# EAGLE design firefly-instrument-serial-wire-debug (EAGLE 7.7.0)
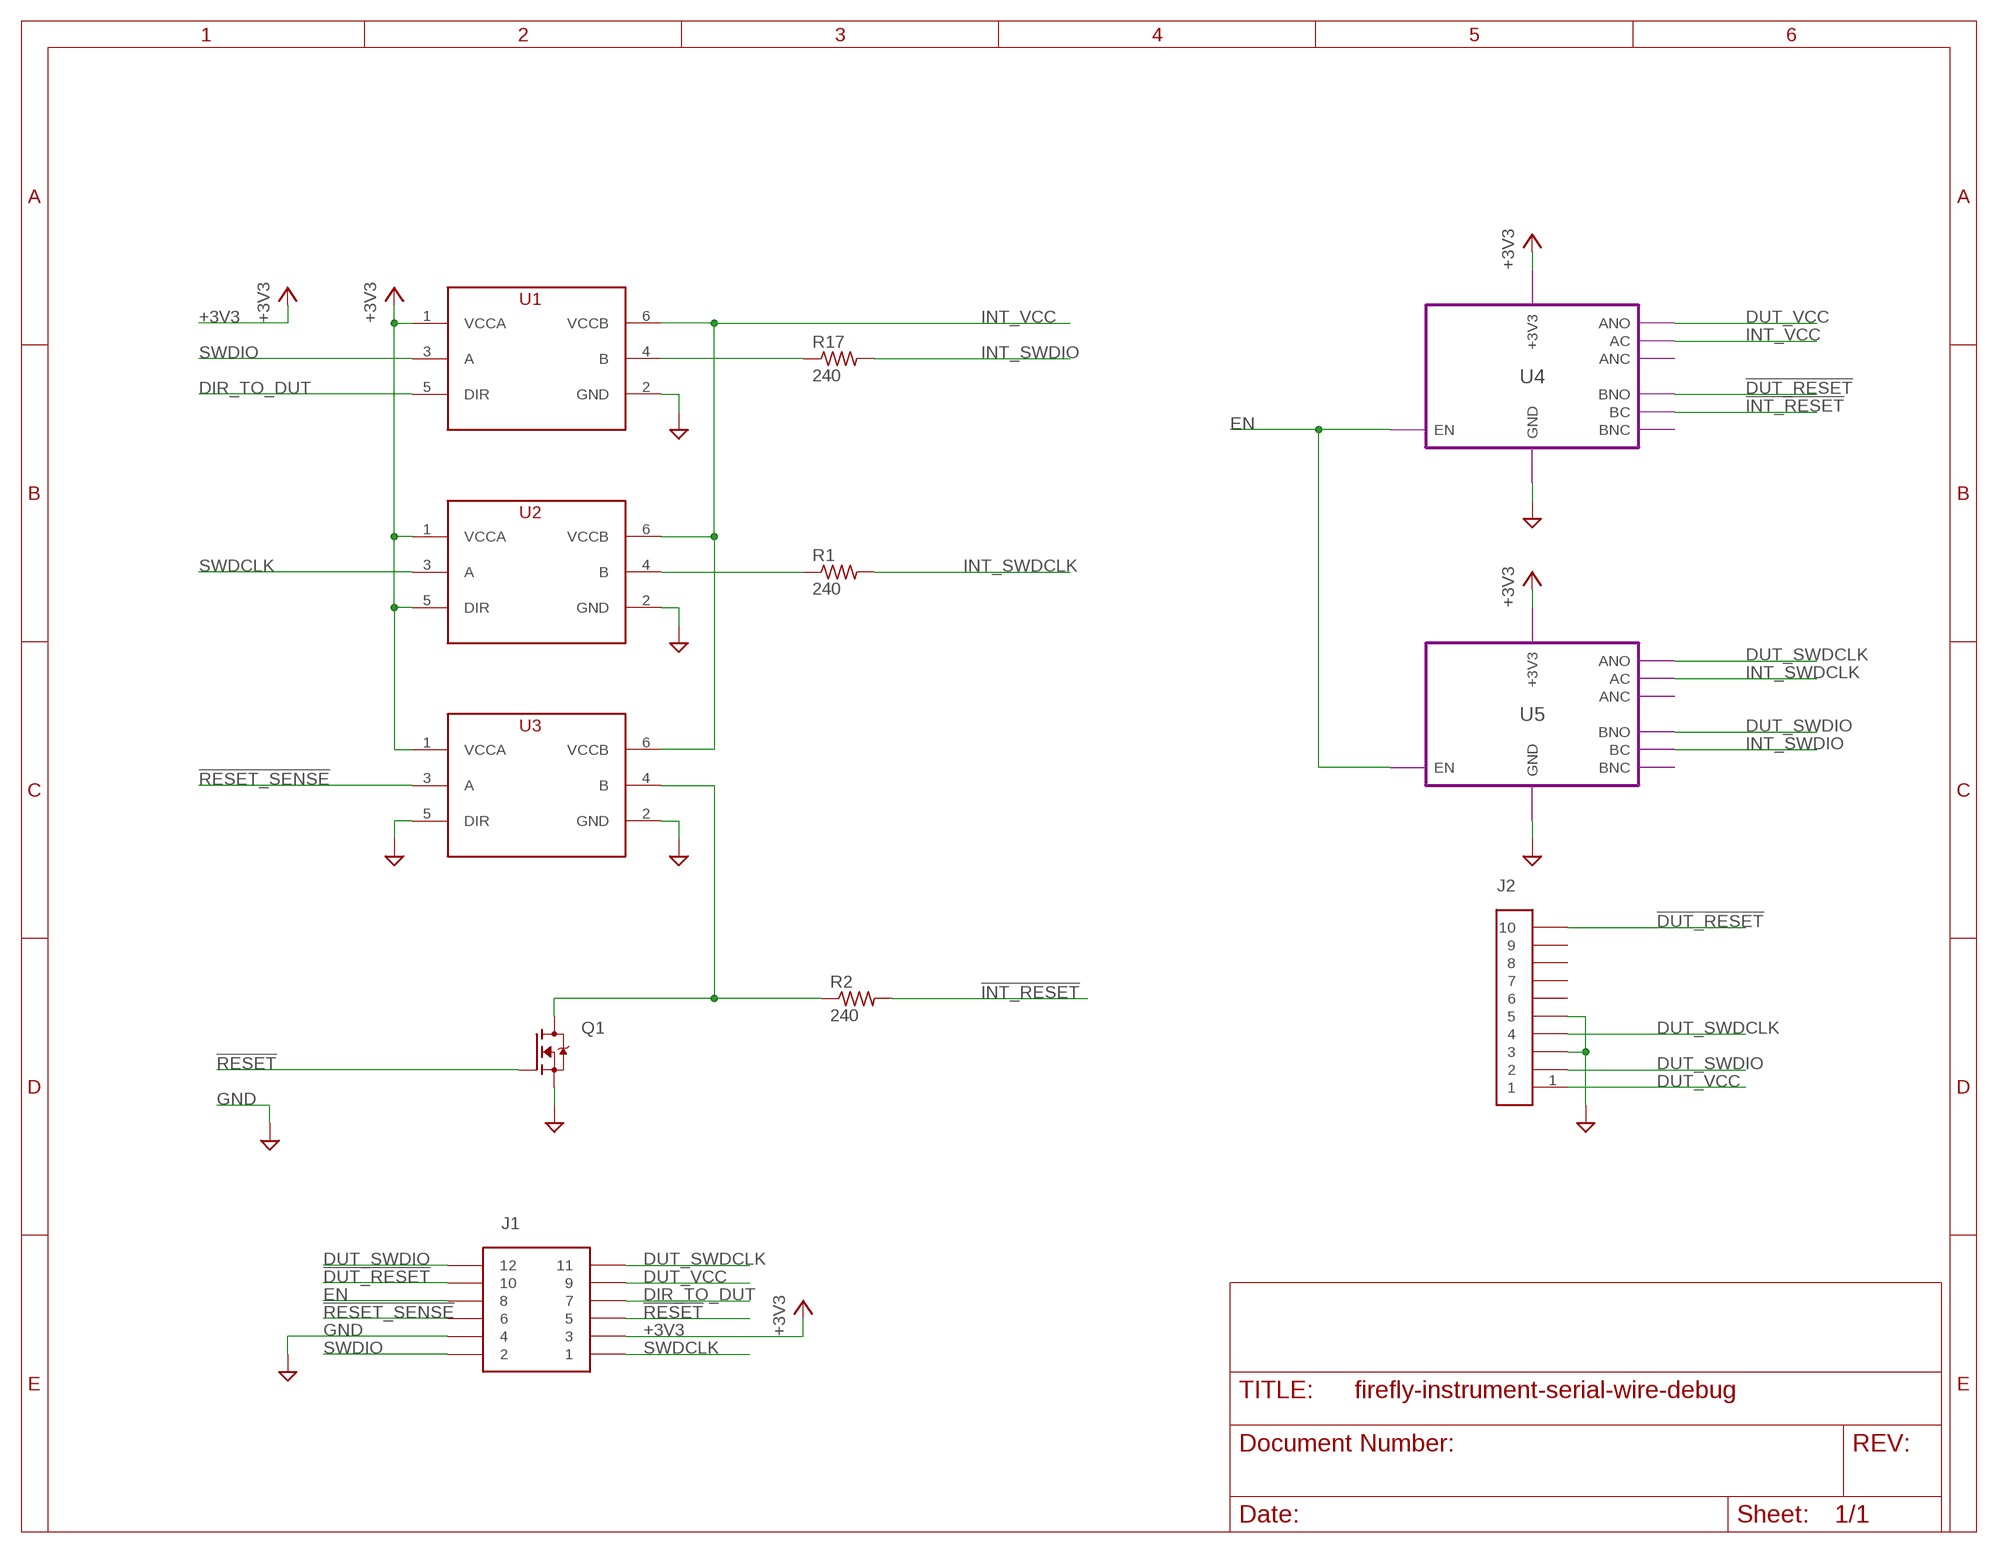
[diagram p0: schematic, sheet 1]

## Parts
J1  CON-12CON-HEADER-2X6  [CON-HEADER-2X6]
J2  CON-10SWD  [SWD-10]
Q1  FET-NMCPH3  [MCPH3]
R1  240  R-USR0805  [R0805]
R2  240  R-USR0805  [R0805]
R17  240  R-USR0805  [R0805]
U1  74LVCH1T45  [SOT363]
U2  74LVCH1T45  [SOT363]
U3  74LVCH1T45  [SOT363]

## Module instances
U4 = RELAY
U5 = RELAY

## Nets
!DUT_RESET: J1.10 J2.10 ; port U4.BNO
!INT_RESET: R2.2 ; port U4.BC
!RESET: J1.5 Q1.1(G)
!RESET_SENSE: J1.6 U3.3(A)
+3V3: J1.3 U1.1(VCCA) U2.1(VCCA) U2.5(DIR) U3.1(VCCA) ; port U4.+3V3 U5.+3V3
DIR_TO_DUT: J1.7 U1.5(DIR)
DUT_SWDCLK: J1.11 J2.4 ; port U5.ANO
DUT_SWDIO: J1.12 J2.2 ; port U5.BNO
DUT_VCC: J1.9 J2.1 ; port U4.ANO
EN: J1.8 ; port U4.EN U5.EN
GND: J1.4 J2.3 J2.5 Q1.2(S) U1.2(GND) U2.2(GND) U3.2(GND) U3.5(DIR) ; port U5.GND U4.GND
INT_SWDCLK: R1.2 ; port U5.AC
INT_SWDIO: R17.2 ; port U5.BC
INT_VCC: U1.6(VCCB) U2.6(VCCB) U3.6(VCCB) ; port U4.AC
N$1: Q1.3(D) R2.1 U3.4(B)
N$2: R17.1 U1.4(B)
N$3: R1.1 U2.4(B)
SWDCLK: J1.1 U2.3(A)
SWDIO: J1.2 U1.3(A)
Unconnected: J2.6 J2.7 J2.8 J2.9

## Library data of the parts
J1 = firefly:CON-12
J2 = firefly:CON-10; MANUFACTURER: Harwin; ORDERING-CODE: M50-3500542
Q1 = firefly:FET-N; MANUFACTURER: ON Semiconductor; ORDERING-CODE: MCH3481-TL-W
R1 R2 R17 = firefly:R-US: RESISTOR, American symbol; MANUFACTURER: Yageo; ORDERING-CODE: RC0805FR-07240RL
U1-U3 = firefly:74LVCH1T45; MANUFACTURER: NXP Semiconductors; ORDERING-CODE: 74LVCH1T45GW,125

## Module RELAY
Ports: ANO(io) AC(io) ANC(io) BNO(io) BC(io) BNC(io) EN(io) +3V3(pwr) GND(pwr)
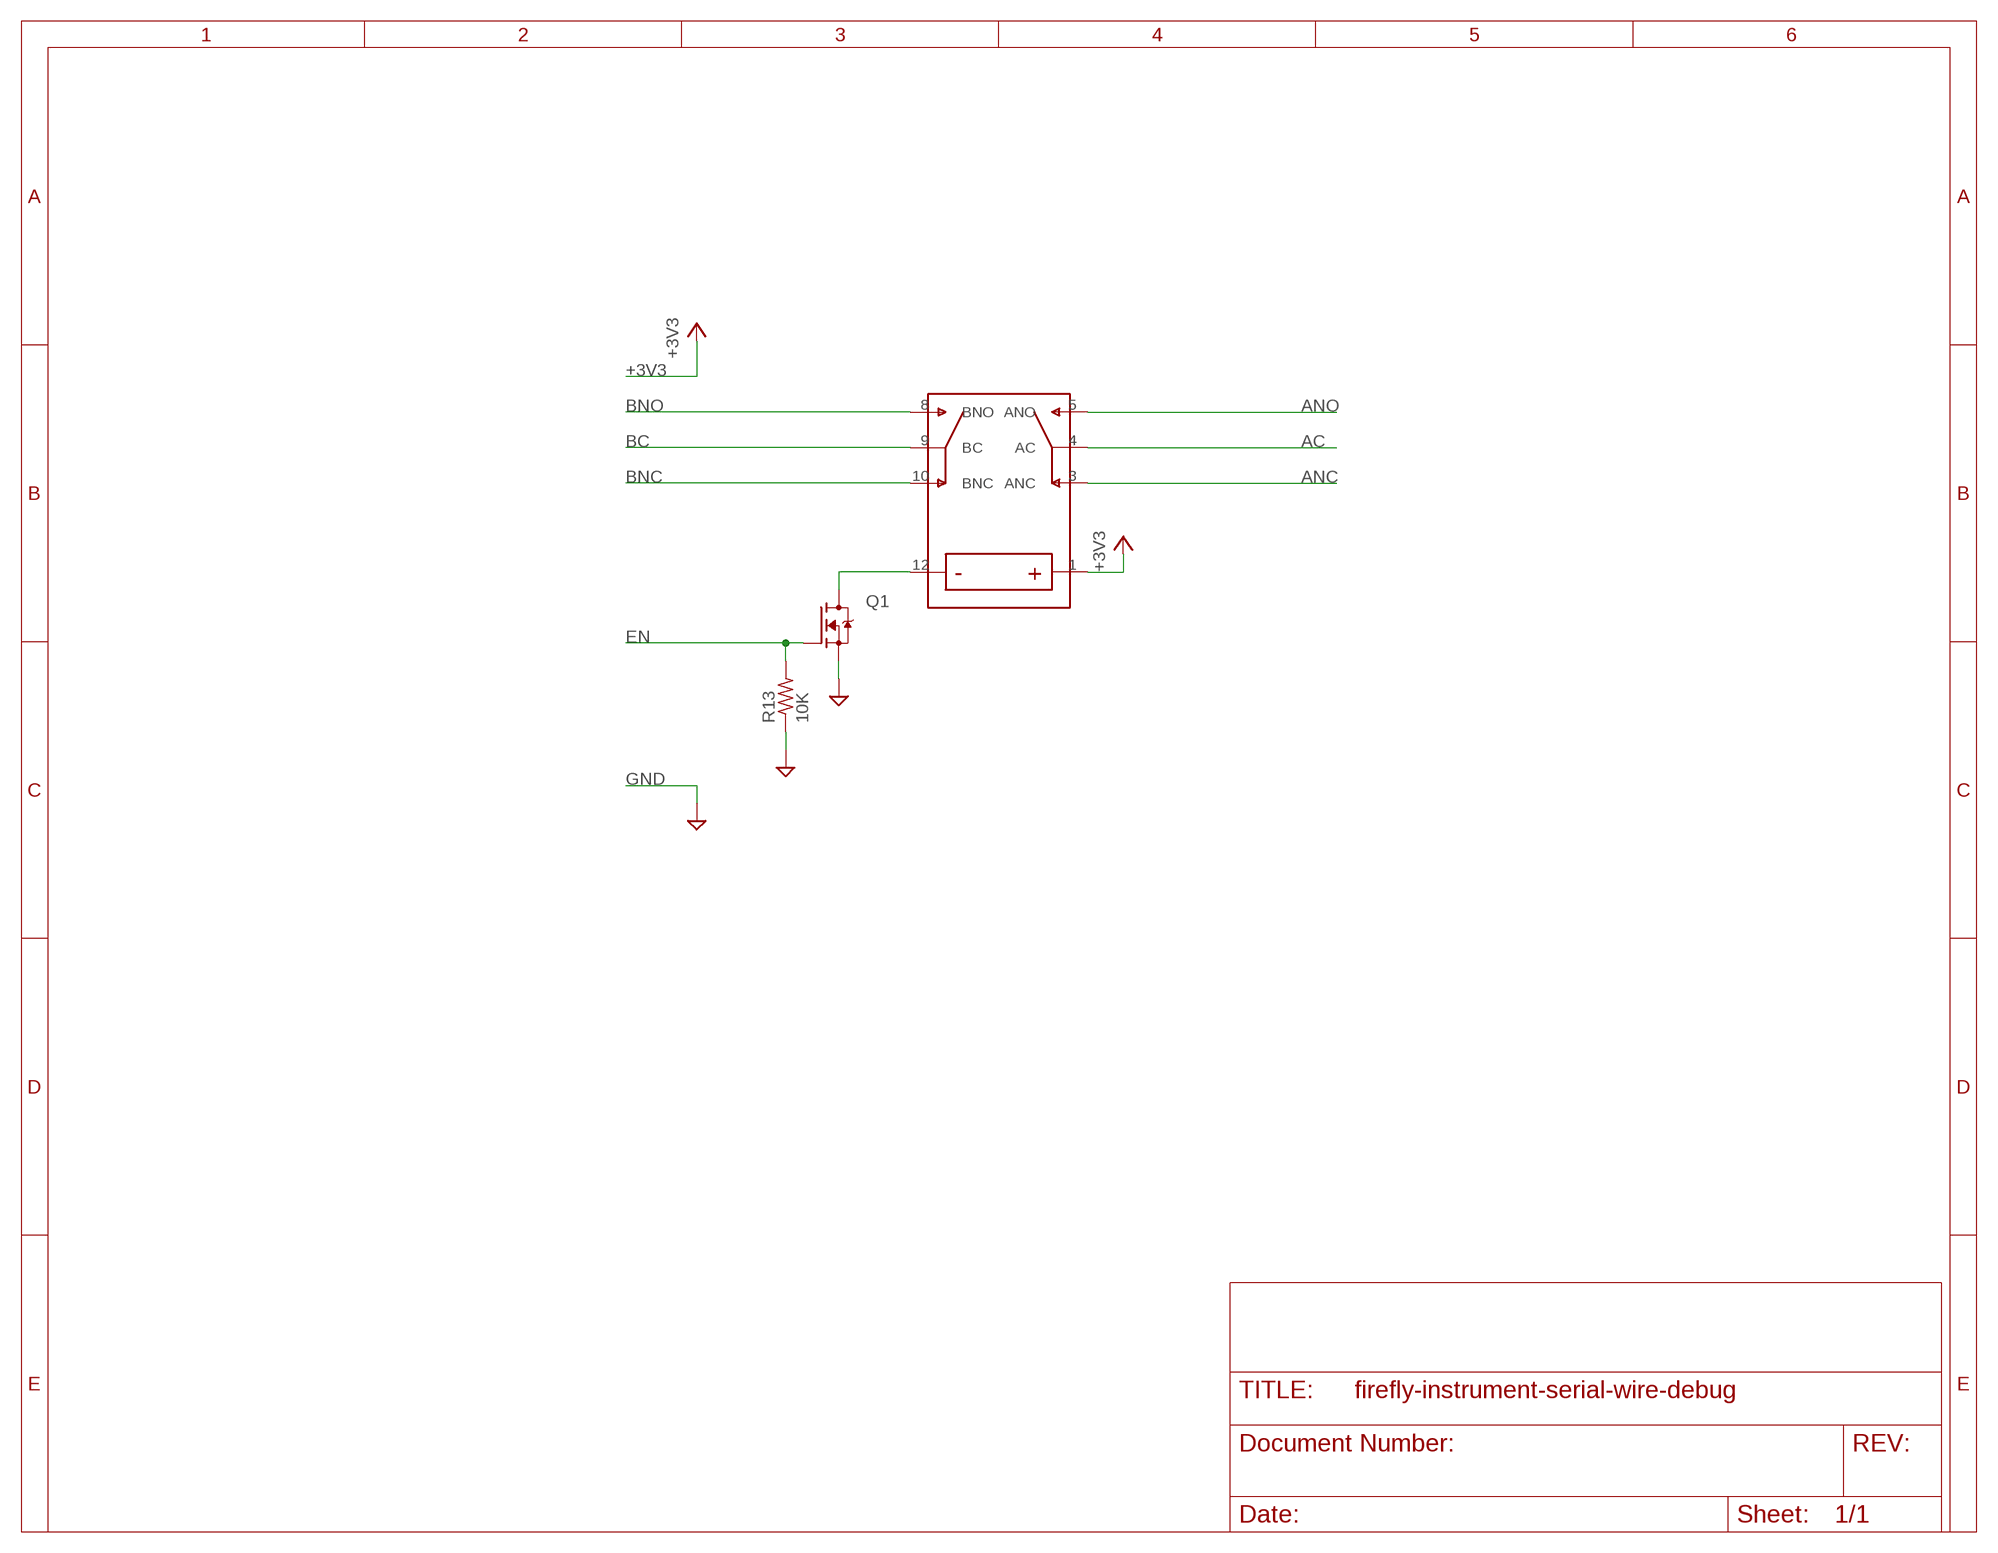
[diagram p1: schematic, module RELAY, sheet 1]

### Parts
Q1  FET-NMCPH3  [MCPH3]
R13  10K  R-USR0805  [R0805]
U1  TXS2SA  [TXS2SA]

### Nets
+3V3: U1.1(+)
AC: U1.4(AC)
ANC: U1.3(ANC)
ANO: U1.5(ANO)
BC: U1.9(BC)
BNC: U1.10(BNC)
BNO: U1.8(BNO)
EN: Q1.1(G) R13.2
GND: Q1.2(S) R13.1
N$2: Q1.3(D) U1.12(-)

### Library data of the parts
Q1 = firefly:FET-N; MANUFACURER: ON Semiconductor; ORDERING-CODE: MCH3481-TL-W
R13 = firefly:R-US: RESISTOR, American symbol; MANUFACTURER: Yageo; ORDERING-CODE: RC0805FR-0710KL
U1 = firefly:TXS2SA; MANUFACTURER: Panasonic Electric Works; ORDERING-CODE: TXS2SA-3V-Z

## Board
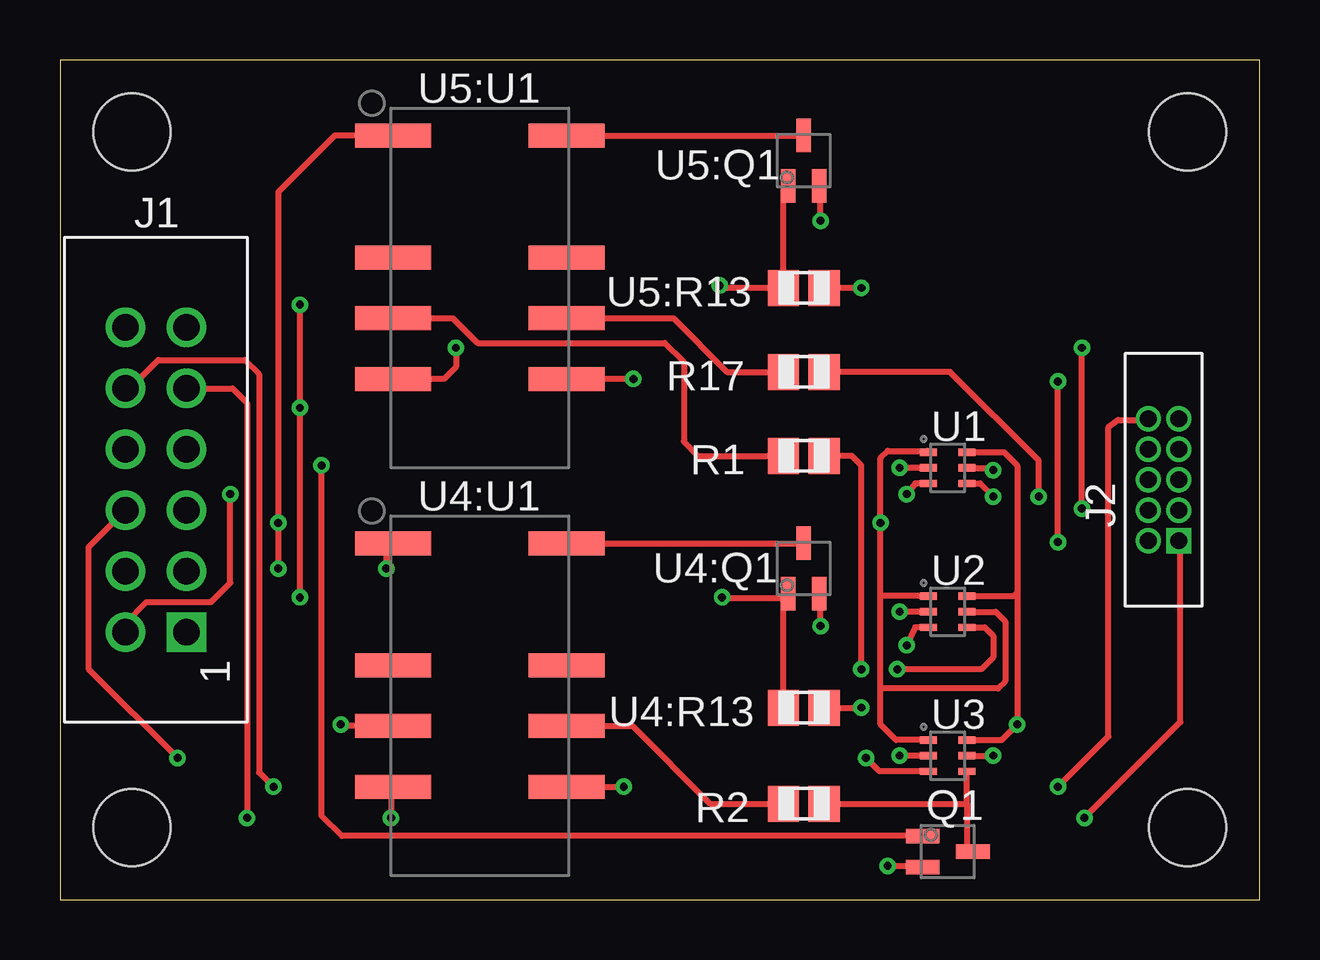
[diagram p2: board, top side]
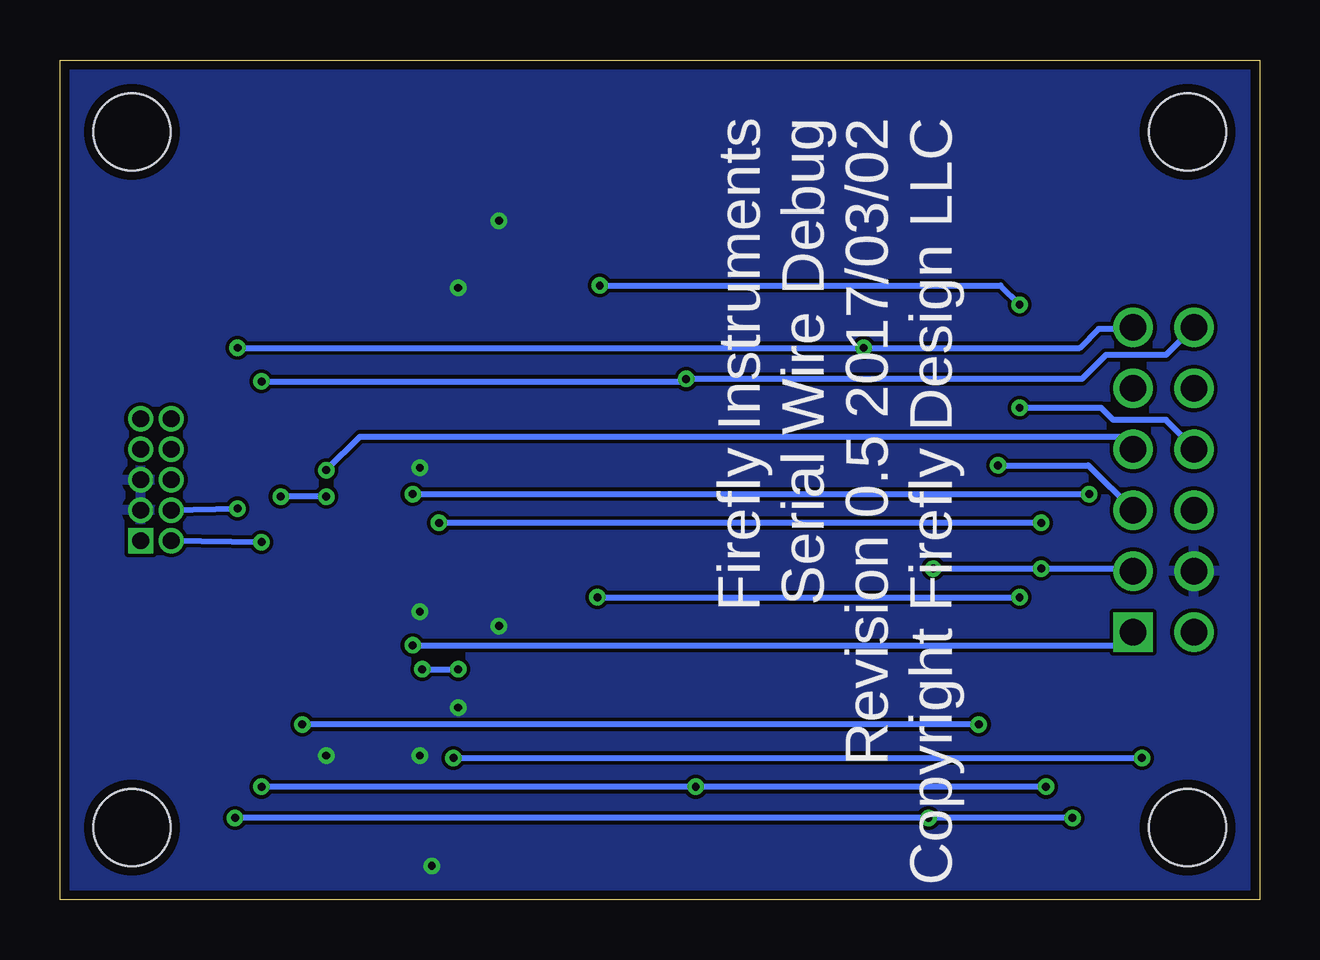
[diagram p3: board, bottom side, seen from below]

Size 50 x 35 mm. Coordinates in mm from the lower left corner, seen from the top.
Outline: 0,0 50,0 50,35 0,35 0,0
Copper layers (1*16): Top 0.0356mm / dielectric 1.5011mm / Bottom 0.0356mm
Design rules "oshpark-2layer": minimum track width 6mil, minimum drill 13mil, track to track 6mil, track to pad 6mil, pad to pad 6mil, via to via 6mil, smd to smd 6mil, copper to edge 15mil, drill to drill 6mil, minimum pad ring 7mil, minimum via ring 7mil, stop-mask expansion 2.5mil, vias tented up to drill 0mil, thermal gap 10mil
Holes 3.2 mm at 3,32 3,3 47,32 47,3

### Footprints (pad centres in the part's own frame; a part is rotated, then mirrored left to right if it is on the bottom)
CON-HEADER-2X6 = drill 1.102 square: 1 -6.35,-1.27 | drill 1.102: 2 -6.35,1.27; 3 -3.81,-1.27; 4 -3.81,1.27; 5 -1.27,-1.27; 6 -1.27,1.27; 7 1.27,-1.27; 8 1.27,1.27; 9 3.81,-1.27; 10 3.81,1.27; 11 6.35,-1.27; 12 6.35,1.27
SWD-10 = drill 0.7 pad 1 square: 1 -2.54,-0.635 | drill 0.7 pad 1: 2 -2.54,0.635; 3 -1.27,-0.635; 4 -1.27,0.635; 5 0,-0.635; 6 0,0.635; 7 1.27,-0.635; 8 1.27,0.635; 9 2.54,-0.635; 10 2.54,0.635
MCPH3 = smd 1.4 x 0.6: 1 -1.05,0.65; 2 -1.05,-0.65; 3 1.05,0
R0805 = smd 1.3 x 1.5: 1 -0.85,0; 2 0.85,0
SOT363 = smd 0.7 x 0.3: 1 -0.8,0.65; 2 -0.8,0; 3 -0.8,-0.65; 4 0.8,-0.65; 5 0.8,0; 6 0.8,0.65
TXS2SA = smd 3.16 x 1: 1 -3.62,6.35; 3 -3.62,1.27; 4 -3.62,-1.27; 5 -3.62,-3.81; 8 3.62,-3.81; 9 3.62,-1.27; 10 3.62,1.27; 12 3.62,6.35

### Placement (x,y rotation side)
J1  4,17.5 90 top
J2  46,17.5 90 top
Q1  37,2 0 top
R1  31,18.5 180 top
R2  31,4 180 top
R17  31,22 180 top
U1  37,18 0 top
U2  37,12 0 top
U3  37,6 0 top
U4:Q1  FET-NMCPH3  [MCPH3]  31,13.8 90 top
U4:R13  10K  [R0805]  31,8 180 top
U4:U1  TXS2SA  [TXS2SA]  17.5,8.5 0 top
U5:Q1  FET-NMCPH3  [MCPH3]  31,30.8 90 top
U5:R13  10K  [R0805]  31,25.5 180 top
U5:U1  TXS2SA  [TXS2SA]  17.5,25.5 0 top

### Tracks (layer width: path | path; a pad name or v marks a point on that pad's centre or on a via)
!DUT_RESET  (via drill 0.33)
  Top 0.254: U4:U1.8 v23.49,4.69 v23.5,4.7 | v41.6,4.7 43.7,6.8 43.7,19.7 44.1,20 45.33,20 J2.10 | J1.10 2.91,21.31 4.1,22.5 7.7,22.5 8.3,21.9 8.3,5.3 v8.9,4.7
  Bottom 0.254: v41.6,4.7 v23.5,4.7 v8.9,4.7
!INT_RESET
  Top 0.254: U4:U1.9 23.87,7.23 27.1,4 R2.2
!RESET  (via drill 0.33)
  Top 0.254: Q1.1 11.75,2.65 10.9,3.5 v10.9,18.1
  Bottom 0.254: v10.9,18.1 7.14,18.1 J1.5
!RESET_SENSE  (via drill 0.33)
  Top 0.254: U3.3 34.15,5.35 v33.6,5.9 | v4.9,5.9 1.2,9.6 1.2,14.7 J1.6
  Bottom 0.254: v33.6,5.9 v4.9,5.9
+3V3  (via drill 0.33)
  Top 0.254: U3.1 34.85,6.65 34.2,7.3 34.2,8.8 | 34.2,8.8 34.2,12.7 | 34.2,12.7 v34.2,15.7 34.2,18.4 34.5,18.7 36.15,18.7 U1.1 | U2.1 34.25,12.65 34.2,12.7 | U2.5 39,12 39.4,11.6 39.4,9.1 39.1,8.8 34.2,8.8 | U5:U1.1 11.45,31.85 9.1,29.5 v9.1,15.7 v9.1,13.8 | U4:U1.1 13.6,14.8 v13.6,13.8
  Bottom 0.254: v9.1,15.7 v34.2,15.7 | J1.3 5.56,13.8 v9.1,13.8 v13.6,13.8
DIR_TO_DUT  (via drill 0.33)
  Top 0.254: U1.5 38.8,18 v38.9,17.9
  Bottom 0.254: v38.9,17.9 37.5,19.3 5.8,19.3 J1.7
DUT_SWDCLK  (via drill 0.33)
  Top 0.254: v42.6,16.3 v42.6,23 | v16.5,23 16.5,22.2 16,21.7 U5:U1.5
  Bottom 0.254: J2.4 v42.6,16.3 | v42.6,23 v16.5,23 7.5,23 6.7,23.8 5.32,23.8 J1.11
DUT_SWDIO  (via drill 0.33)
  Top 0.254: v41.6,14.9 v41.6,21.6 | v23.9,21.7 U5:U1.8
  Bottom 0.254: J2.2 v41.6,14.9 | v41.6,21.6 24,21.6 v23.9,21.7 7.4,21.7 6.4,22.7 3.9,22.7 2.75,23.85 J1.12
DUT_VCC  (via drill 0.33)
  Top 0.254: U4:U1.5 13.8,4.3 v13.8,3.4 | v42.7,3.4 46.7,7.4 46.7,14.89 J2.1 | J1.9 7.19,21.31 7.8,20.7 v7.8,3.4
  Bottom 0.254: v42.7,3.4 v13.8,3.4 v7.8,3.4
EN  (via drill 0.33)
  Top 0.254: U4:R13.2 30.15,12.55 | 30.15,12.55 U4:Q1.1 | U5:Q1.1 30.15,29.55 U5:R13.2 27.6,25.5 v27.5,25.6 | 30.15,12.55 27.65,12.55 v27.6,12.6 | v10,24.8 v10,20.5 v10,12.6
  Bottom 0.254: v27.6,12.6 v10,12.6 | v27.5,25.6 10.8,25.6 v10,24.8 | J1.8 2.73,18.83 3.9,20 6.1,20 6.6,20.5 v10,20.5
GND  (via drill 0.33)
  Top 0.254: v31.7,28.3 31.7,29.7 U5:Q1.2 | v33.4,25.5 U5:R13.1 | U1.2 v35,18 | U2.2 v35,12 | U3.2 v35,6 | v34.5,1.4 35.9,1.4 Q1.2 | v31.7,11.4 31.7,12.7 U4:Q1.2 | U4:R13.1 v33.4,8 | U3.5 v38.9,6
  pour Bottom: 0.1,0 50,0 50,35 0,35 0,0
INT_SWDCLK
  Top 0.254: U5:U1.4 16.37,24.23 17.4,23.2 25.2,23.2 26,22.4 26,19.1 26.6,18.5 R1.2
INT_SWDIO
  Top 0.254: U5:U1.9 25.57,24.23 27.8,22 R17.2
INT_VCC  (via drill 0.33)
  Top 0.254: U1.6 39.35,18.65 39.9,18.1 39.9,12.8 | 39.9,12.8 v39.9,7.3 39.25,6.65 U3.6 | U2.6 39.75,12.65 39.9,12.8 | U4:U1.4 11.77,7.23 v11.7,7.3
  Bottom 0.254: v11.7,7.3 v39.9,7.3
N$1
  Top 0.254: R2.1 37.8,4 | 37.8,4 U3.4 | 37.8,4 37.8,2.25 Q1.3
N$2  (via drill 0.33)
  Top 0.254: U1.4 38.35,17.35 v38.9,16.8 | v40.8,16.8 40.8,18.3 37.1,22 R17.1
  Bottom 0.254: v38.9,16.8 v40.8,16.8
N$3  (via drill 0.33)
  Top 0.254: U2.4 38.55,11.35 38.9,11 38.9,10.1 38.4,9.6 v34.9,9.6 | v33.4,9.6 33.4,18.1 33,18.5 R1.1
  Bottom 0.254: v34.9,9.6 v33.4,9.6
SWDCLK  (via drill 0.33)
  Top 0.254: U2.3 35.65,11.35 v35.3,10.6
  Bottom 0.254: v35.3,10.6 5.82,10.6 J1.1
SWDIO  (via drill 0.33)
  Top 0.254: U1.3 35.65,17.35 v35.3,16.9 | J1.2 2.73,11.53 3.6,12.4 6.3,12.4 7.1,13.2 v7.1,16.9
  Bottom 0.254: v35.3,16.9 v7.1,16.9
U4:N$2
  Top 0.254: U4:U1.12 U4:Q1.3
U5:N$2
  Top 0.254: U5:U1.12 U5:Q1.3

### Text on the board
_bsilk: Firefly Instruments / Serial Wire Debug / Revision 0.5 2017/03/02 / Copyright Firefly Design LLC